# EAGLE design HM-RC-8_Remote-v02-010 (EAGLE 9.1.1)
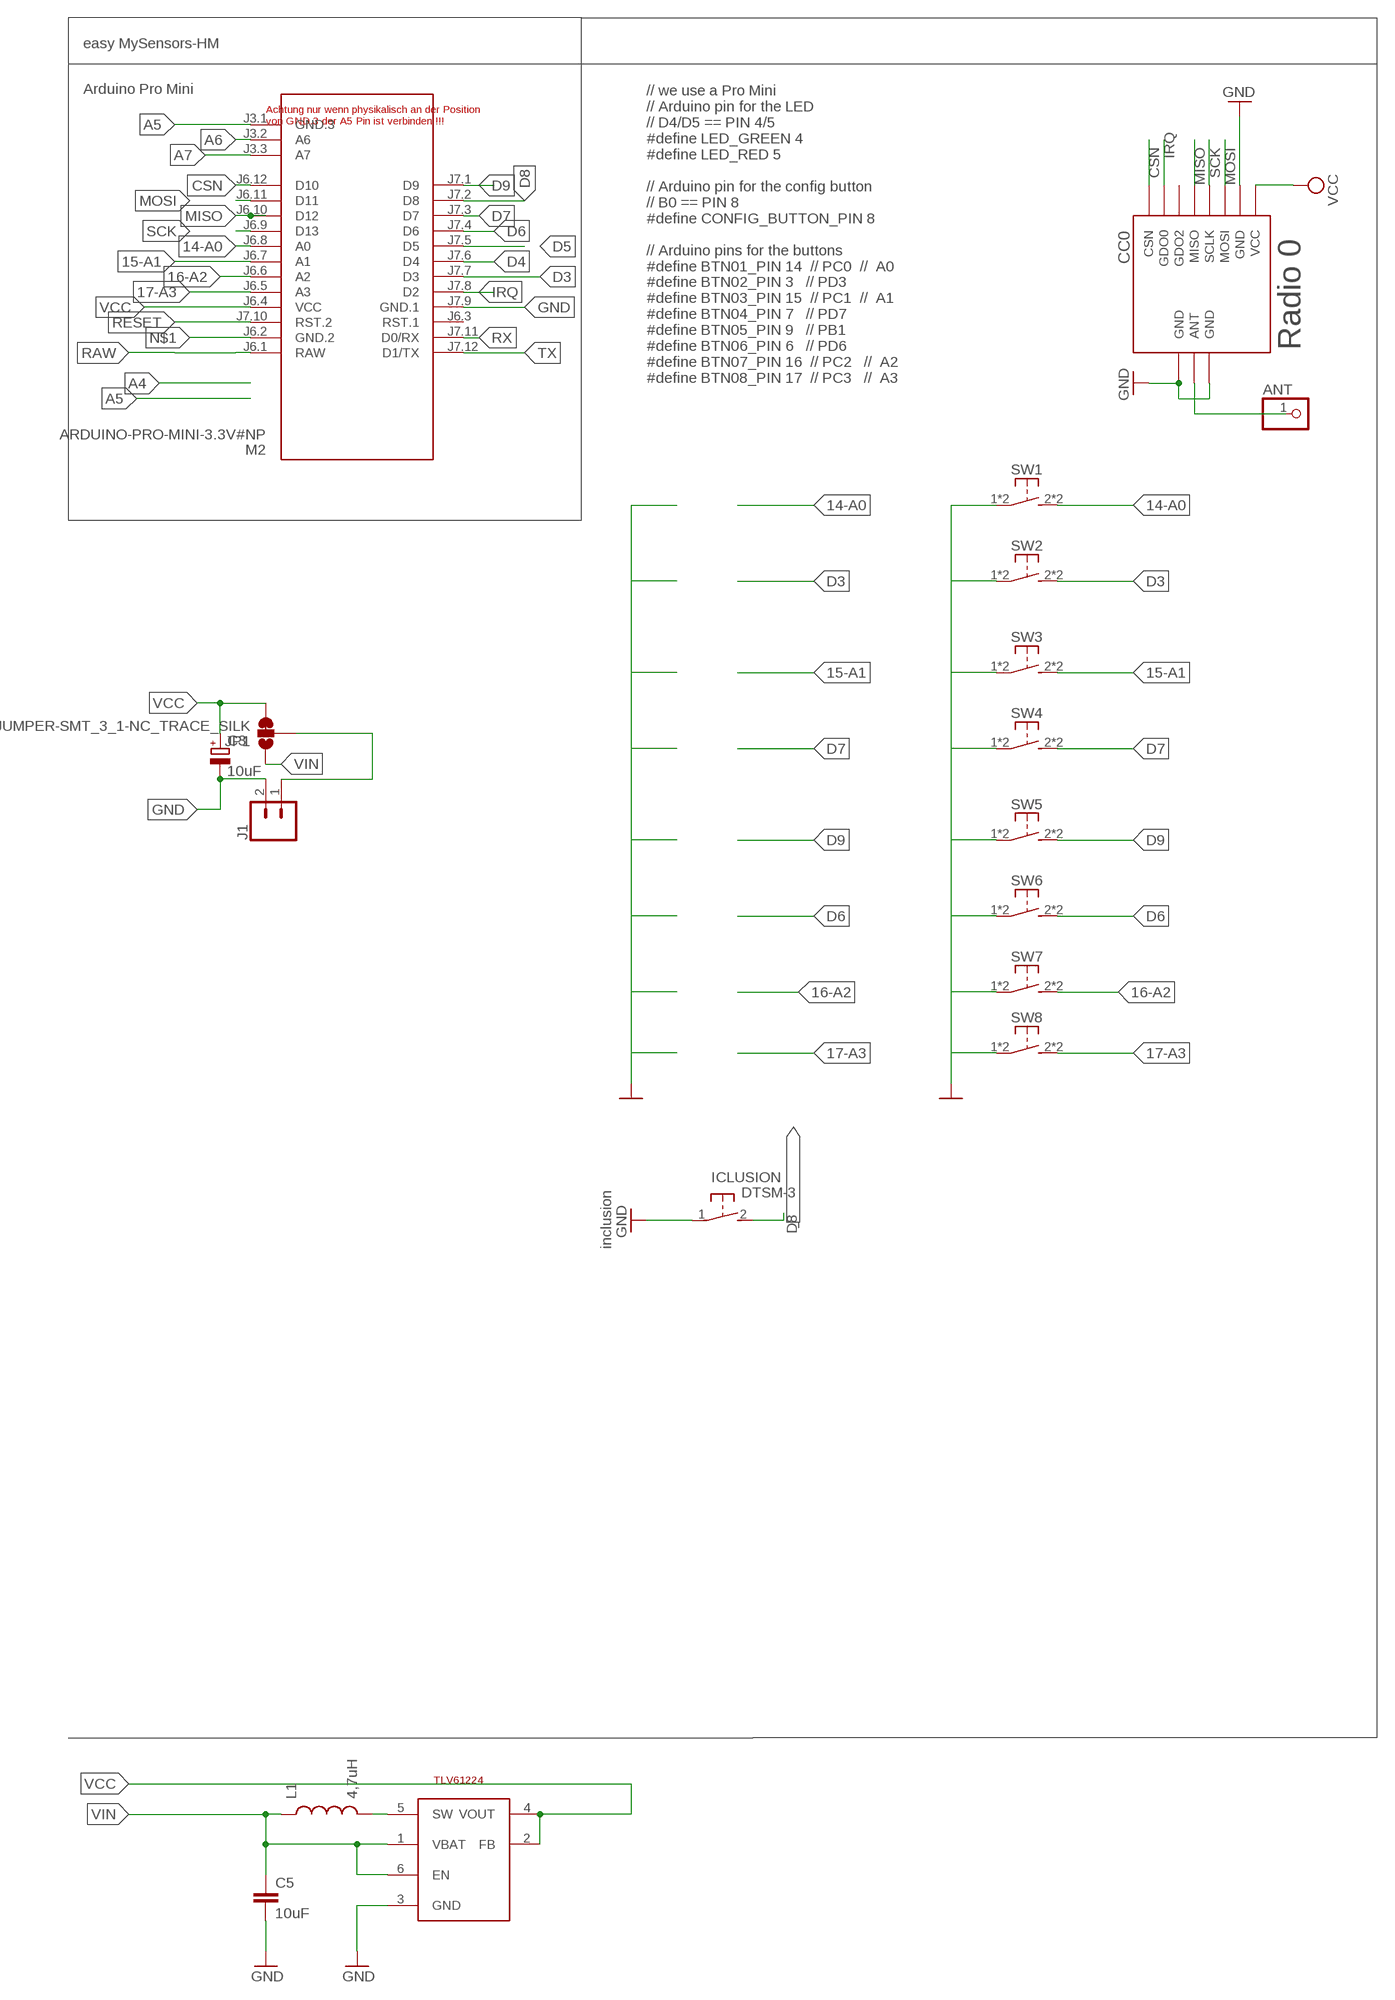
[diagram p0: schematic, sheet 1]

## Parts
ANT  PINHD-1X1  [1X01]
C3  10uF  CPOL-EUSMCC  [SMC_C]
C5  10uF  CAP0805  [0805]
CC0  CC1101  CC1101_MODULE1SMD  [CC1101_MODULE1_SMD]
ICLUSION  DTSM-3  [DTSM-3]
J1  CONN_02PTH3  [1X02_LONGPADS]
JP1  JUMPER-SMT_3_1-NC_TRACE_SILK  [SMT-JUMPER_3_1-NC_TRACE_SILK]
L1  4,7uH  INDUCTOR0805  [0805]
M2  ARDUINO-PRO-MINI-3.3V#NP  [ARDUINO-PRO-MINI#NP]
STEPUP  TLV61224  TI-TLV61224  [SOT23-6L]
SW1  SW-TACTILE-TL3305  [TL3305]
SW2  SW-TACTILE-TL3305  [TL3305]
SW3  SW-TACTILE-TL3305  [TL3305]
SW4  SW-TACTILE-TL3305  [TL3305]
SW5  SW-TACTILE-TL3305  [TL3305]
SW6  SW-TACTILE-TL3305  [TL3305]
SW7  SW-TACTILE-TL3305  [TL3305]
SW8  SW-TACTILE-TL3305  [TL3305]

## Nets
14-A0: M2.J6.8(A0) SW1.2(S1) SW1.3(S1)
15-A1: M2.J6.7(A1) SW3.2(S1) SW3.3(S1)
16-A2: M2.J6.6(A2) SW7.2(S1) SW7.3(S1)
17-A3: M2.J6.5(A3) SW8.2(S1) SW8.3(S1)
A5: M2.J3.1(GND.3)
A6: M2.J3.2(A6)
A7: M2.J3.3(A7)
ANT0: ANT.1 CC0.ANT
CSN: CC0.CSN M2.J6.12(D10)
D3: M2.J7.7(D3) SW2.2(S1) SW2.3(S1)
D4: M2.J7.6(D4)
D5: M2.J7.5(D5)
D6: M2.J7.4(D6) SW6.2(S1) SW6.3(S1)
D7: M2.J7.3(D7) SW4.2(S1) SW4.3(S1)
D8: ICLUSION.2 M2.J7.2(D8)
D9: M2.J7.1(D9) SW5.2(S1) SW5.3(S1)
GND [Power]: C3.- C5.2 CC0.GND@0(GND) CC0.GND@1(GND) CC0.GND@2(GND) ICLUSION.1 J1.2 M2.J7.9(GND.1) STEPUP.3(GND) SW1.1 SW1.4(P1) SW3.1 SW3.4(P1) SW4.1 SW4.4(P1) SW5.1 SW5.4(P1) SW6.1 SW6.4(P1) SW7.1 SW7.4(P1) SW8.1 SW8.4(P1)
IRQ: CC0.GDO0 M2.J7.8(D2)
MISO: CC0.MISO M2.J6.10(D12)
MOSI: CC0.MOSI M2.J6.11(D11)
N$1 [Power]: M2.J6.2(GND.2)
N$3: SW2.1 SW2.4(P1)
N$4: J1.1 JP1.2
N$13: L1.2 STEPUP.5(SW)
RAW [Power]: M2.J6.1(RAW)
RESET: M2.J7.10(RST.2)
RX: M2.J7.11(D0/RX)
SCK: CC0.SCLK M2.J6.9(D13)
TX: M2.J7.12(D1/TX)
VCC [Power]: C3.+ CC0.VCC JP1.3 M2.J6.4(VCC) STEPUP.2(FB) STEPUP.4(VOUT)
VIN: C5.1 JP1.1 L1.1 STEPUP.1(VBAT) STEPUP.6(EN)
Unconnected: CC0.GDO2 M2.J6.3(RST.1)

## Notes on the sheet
- easy MySensors-HM
- Arduino Pro Mini
- Achtung nur wenn physikalisch an der Position 
  von GND.3 der A5 Pin ist verbinden !!!
- Radio 0
- // we use a Pro Mini
  // Arduino pin for the LED
  // D4/D5 == PIN 4/5
  #define LED_GREEN 4
  #define LED_RED 5
  
  // Arduino pin for the config button
  // B0 == PIN 8
  #define CONFIG_BUTTON_PIN 8
  
  // Arduino pins for the buttons
  #define BTN01_PIN 14  // PC0  //  A0
  #define BTN02_PIN 3   // PD3  
  #define BTN03_PIN 15  // PC1  //  A1
  #define BTN04_PIN 7   // PD7
  #define BTN05_PIN 9   // PB1
  #define BTN06_PIN 6   // PD6
  #define BTN07_PIN 16  // PC2   //  A2
  #define BTN08_PIN 17  // PC3   //  A3
- inclusion

## Library data of the parts
ANT = pinhead:PINHD-1X1: PIN HEADER
C3 = rcl:CPOL-EU: POLARIZED CAPACITOR, European symbol; SPICEPREFIX: C
C5 = SparkFun-Passives:CAP: Capacitor Standard 0603 ceramic capacitor, and 0.1" leaded capacitor.
CC0 = wireless:CC1101_MODULE1: CC1101 wireless module for 433/868 MHz (sold from Aliexpress). DIL version for mounting with pin header (and SMD soldering) and SMD only variant available.
ICLUSION = mechanics:DTSM-3: Diptronics SMD button 6x3.5 mm
J1 = SparkFun-Connectors:CONN_02: Multi connection point. Often used as Generic Header-pin footprint for 0.1 inch spaced/style header connections On any of the 0.1 inch spaced packages, you can populate with these: Break Away Headers - Straight <https://www.sparkfun.com/products/116> (PRT-00116) Break Away Male Headers - Right Angle <https://www.sparkfun.com/products/553> (PRT-00553) Female Headers <https://www.sparkfun.com/products/115> (PRT-00115) Break Away Headers - Machine Pin <https://www.sparkfun.com/products/117> (PRT-00117) Break Away Female Headers - Swiss Machine Pin <https://www.sparkfun.com/products/743> (PRT-00743) For SCREWTERMINALS and SPRING TERMINALS visit here: Screw Terimnals on SparkFun.com <https://www.sparkfun.com/search/results?term=Screw+Terminals> (5mm/3.5mm/2.54mm spacing) This device is also useful as a general connection point to wire up your design to another part of your project. Our various solder wires solder well into these plated through hole pads. Hook-Up Wire - Assortment (Stranded, 22 AWG) <https://www.sparkfun.com/products/11375> (PRT-11375) Hook-Up Wire - Assortment (Solid Core, 22 AWG) <https://www.sparkfun.com/products/11367> (PRT-11367) View the entire wire category on our website here <https://www.sparkfun.com/categories/141> Special notes: Molex polarized connector foot print use with: PRT-08233 with associated crimp pins and housings. 2.54_SCREWTERM for use with PRT-10571. 3.5mm Screw Terminal footprints for PRT-08084 5mm Screw Terminal footprints for use with PRT-08432
JP1 = SparkFun-Jumpers:JUMPER-SMT_3_1-NC_TRACE: Normally closed trace jumper (1 of 2 connections) This jumper has a trace between two pads so it's normally closed (NC). The other connection is normally open (NO). Use a razor knife to open the connection. For best results follow the IPC guidelines for cutting traces: Cutout at least 0.063 mm (0.005 in). Remove all loose material to clean up the cut area. Seal the cut with an approved epoxy. Reapply solder to reclose the connection, or to close the NO connection.
L1 = SparkFun-Passives:INDUCTOR: Inductors Basic Inductor/Choke - 0603 and 1206. Footprints are not proven and vary greatly between part numbers.
M2 = diy-modules-Martin:ARDUINO-PRO-MINI-*#NP: Arduino Pro Mini (and compatible devices) without programming pads More details available here: https://www.arduino.cc/en/Main/ArduinoBoardProMini Click here to find device on ebay.com <http://www.ebay.com/sch/arduino+pro+mini>
STEPUP = TLV61224:TI-TLV61224
SW1-SW8 = we-switch:SW-TACTILE: Tactile Switches

## Net classes
0 default: width 0.305 mm
1 Power: width 0.508 mm

## Board
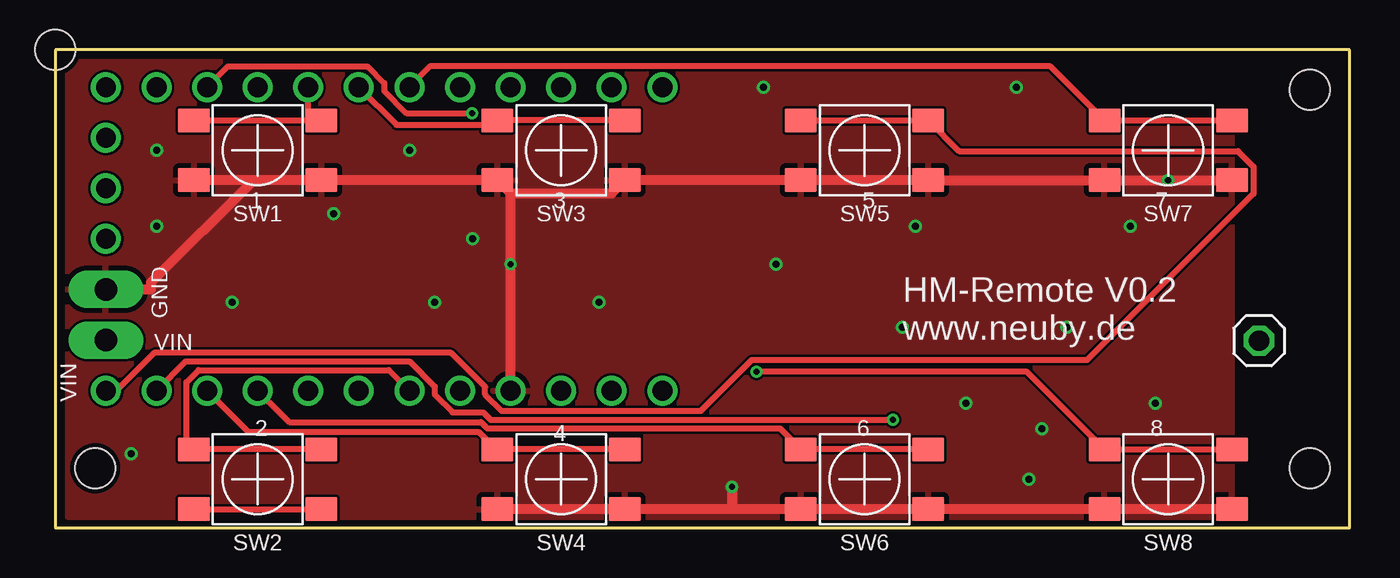
[diagram p1: board, top side]
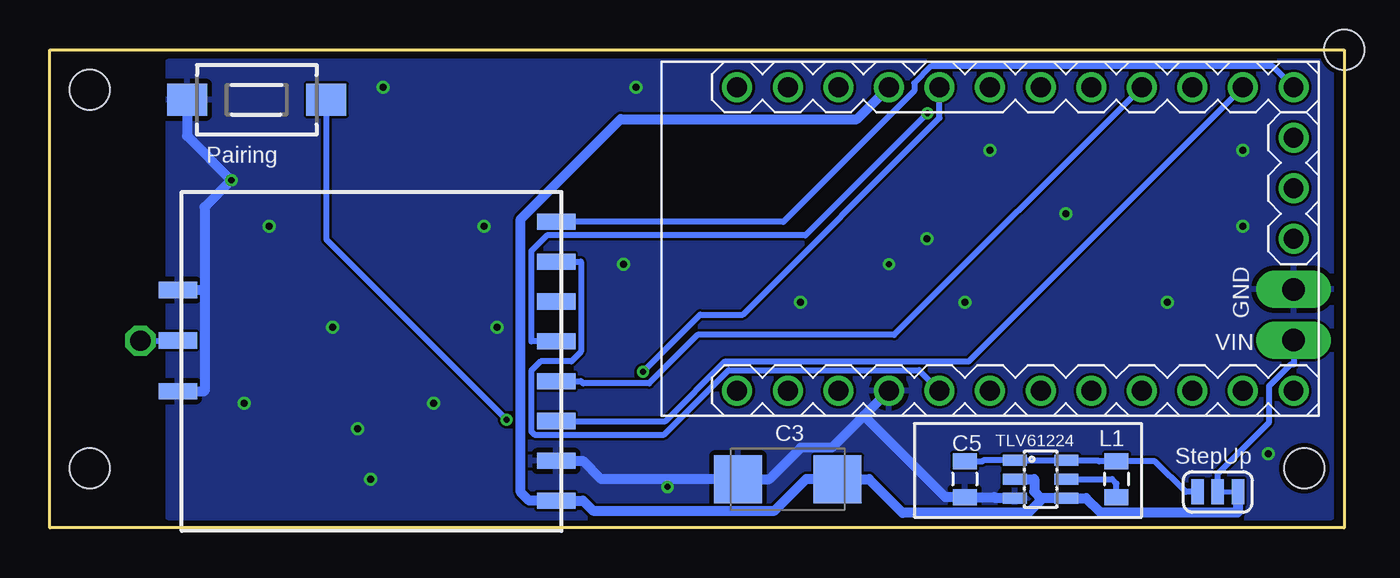
[diagram p2: board, bottom side, seen from below]

Size 65 x 24 mm. Coordinates in mm from the lower left corner, seen from the top.
Outline: 0,0 65,0 65,24 0,24 0,0
Copper layers (1*16): Top 0.035mm / dielectric 1.5mm / Bottom 0.035mm
Design rules "dirt_cheap_dirty_boards.v1": minimum track width 5mil, minimum drill 12mil, track to track 5mil, track to pad 5mil, pad to pad 5mil, via to via 5mil, smd to smd 0mil, copper to edge 10mil, drill to drill 10mil, minimum pad ring 10mil, minimum via ring 6mil, stop-mask expansion 2mil, vias tented up to drill 25mil, thermal gap 10mil
Holes 2 mm at 2,3 0,24 63,22 63,3

### Footprints (pad centres in the part's own frame; a part is rotated, then mirrored left to right if it is on the bottom)
1X01 = drill 1.016 octagon: 1 0,0
SMC_C = smd 2.4 x 2.4: + -2.5,0; - 2.5,0
0805 = smd 0.8 x 1.2: 1 -0.9,0; 2 0.9,0
CC1101_MODULE1_SMD = smd 1.93 x 0.813: ANT 19,5.96; CSN 0,0; GDO0 0,2; GDO2 0,4; GND@0 0,12; GND@1 19,8.5; GND@2 19,3.42; MISO 0,6; MOSI 0,10; SCLK 0,8; VCC 0,14
DTSM-3 = smd 2 x 1.6: 1 -3.494,0; 2 3.494,0
1X02_LONGPADS = drill 1.118 pad 1.88 long: 1 0,0; 2 2.54,0
SMT-JUMPER_3_1-NC_TRACE_SILK = smd 0.635 x 1.27: 1 -1.016,0; 2 0,0; 3 1.016,0
ARDUINO-PRO-MINI#NP = drill 1: J3.1 15.24,0; J3.2 15.24,2.54; J3.3 15.24,5.08; J6.1 -12.7,7.62; J6.2 -10.16,7.62; J6.3 -7.62,7.62; J6.4 -5.08,7.62; J6.5 -2.54,7.62; J6.6 0,7.62; J6.7 2.54,7.62; J6.8 5.08,7.62; J6.9 7.62,7.62; J6.10 10.16,7.62; J6.11 12.7,7.62; J6.12 15.24,7.62; J7.1 15.24,-7.62; J7.2 12.7,-7.62; J7.3 10.16,-7.62; J7.4 7.62,-7.62; J7.5 5.08,-7.62; J7.6 2.54,-7.62; J7.7 0,-7.62; J7.8 -2.54,-7.62; J7.9 -5.08,-7.62; J7.10 -7.62,-7.62; J7.11 -10.16,-7.62; J7.12 -12.7,-7.62
SOT23-6L = smd 0.55 x 1.2: 1 -0.95,-1.3; 2 0,-1.3; 3 0.95,-1.3; 4 0.95,1.3; 5 0,1.3; 6 -0.95,1.3
TL3305 = smd 1.6 x 1.2: 1 -3.2,1.5; 2 -3.2,-1.5; 3 3.2,-1.5; 4 3.2,1.5

### Placement (x,y rotation side)
ANT  60.45,9.4 0 top
C3  27.94,2.45 180 bottom
C5  19.05,2.45 270 bottom
CC0  39.58,15.36 180 bottom
ICLUSION  54.61,21.5 0 bottom
J1  2.54,9.43 90 top
JP1  6.35,1.81 0 bottom
L1  11.43,2.45 270 bottom
M2  17.78,14.51 0 bottom
STEPUP  15.24,2.45 270 bottom
SW1  10.16,18.95 180 top
SW2  10.16,2.45 180 top
SW3  25.4,18.95 180 top
SW4  25.4,2.45 180 top
SW5  40.64,18.95 180 top
SW6  40.64,2.45 180 top
SW7  55.88,18.95 180 top
SW8  55.88,2.45 180 top

### Tracks (layer width: path | path; a pad name or v marks a point on that pad's centre or on a via)
14-A0
  Top 0.305: 12.7,20.45 SW1.2 | SW1.3 12.7,20.45 | 12.7,20.45 M2.J6.8
15-A1
  Top 0.305: M2.J6.7 17.14,20.23 21.98,20.23 SW3.3 SW3.2
16-A2
  Top 0.305: M2.J6.6 18.81,23.16 49.97,23.16 SW7.3 SW7.2
17-A3  (via drill 0.3 pad 0.61)
  Top 0.305: v35.21,7.83 48.79,7.83 SW8.3 SW8.2
  Bottom 0.305: v35.21,7.83 32.34,10.71 30.2,10.71 20.32,20.58 M2.J6.5
ANT0
  Bottom 0.305: ANT.1 59.41,9.4 59.4,9.4 CC0.ANT
CSN
  Bottom 0.305: M2.J6.12 3.58,23.17 20.75,23.17 21.59,22.33 21.59,21.93 28.16,15.36 CC0.CSN
D3
  Top 0.305: M2.J7.7 16.74,7.93 7.19,7.93 6.59,7.32 6.59,4.32 SW2.3 SW2.2
D6
  Top 0.305: M2.J7.4 11.75,5.3 21.37,5.3 21.68,4.99 36.39,4.99 SW6.3 SW6.2
D7
  Top 0.305: M2.J7.3 9.69,4.82 21.24,4.82 22.12,3.95 SW4.3 SW4.2
D8  (via drill 0.3 pad 0.61)
  Top 0.305: M2.J7.2 6.55,8.36 17.78,8.36 19.05,7.09 19.05,6.69 19.94,5.8 21.49,5.8 21.86,5.42 v42.06,5.42
  Bottom 0.305: ICLUSION.2 51.12,14.48 v42.06,5.42
D9
  Top 0.305: M2.J7.1 3.06,6.89 4.96,8.79 19.89,8.79 21.59,7.09 21.59,6.69 22.43,5.86 32.41,5.86 34.97,8.42 51.8,8.42 60.16,16.77 60.16,18.14 59.39,18.91 45.39,18.91 SW5.2 SW5.3
GND  (via drill 0.3 pad 0.61, 0.35)
  Top 0.508: SW7.1 v55.88,17.45 SW7.4 SW5.1 SW5.4 SW3.1 27.94,16.8 22.86,16.8 | 33.98,0.94 SW4.1 SW4.4 | 33.98,0.94 SW6.4 SW6.1 SW8.4 SW8.1 | v33.98,2.05 33.98,0.94 | 22.86,16.8 SW3.4 SW1.1 9.95,17.45 | M2.J7.9 v22.86,13.24 22.86,16.8 | J1.2 4.8,11.97 4.8,12.31 9.95,17.45 | 9.95,17.45 SW1.4
  Bottom 0.508: CC0.GND@1 57.23,6.87 57.23,11.95 | 57.23,11.95 57.23,16.11 v55.88,17.45 58.1,19.68 ICLUSION.1 | CC0.GND@2 57.23,11.95 | 33.98,2.45 37.31,2.45 38.23,3.37 CC0.GND@0 | 33.98,2.45 32.02,2.45 C3.- 28.86,2.45 27.28,4.03 25.72,4.03 24.12,5.63 | 33.98,2.45 v33.98,2.05 | M2.J7.9 24.12,5.63 | 24.12,5.63 20.03,1.54 C5.2 17.57,1.54 17.52,1.5 STEPUP.3
  other vias: 20.95,14.51 17.78,18.95 5.08,18.95 5.08,15.14 3.81,3.71 8.89,11.34 19.05,11.34 13.97,15.78 27.3,11.34 35.56,22.13 48.26,22.13 43.18,15.14 36.2,13.24 42.55,10.06 50.8,10.06 53.98,15.14 55.24,6.26 49.53,4.99 45.72,6.26 48.9,2.45
  pour Bottom: 0.64,0.54 0.64,23.4 59.05,23.4 59.05,0.54
  pour Top: 0.64,0.54 0.64,23.4 59.05,23.4 59.05,0.54
IRQ
  Bottom 0.305: CC0.GDO0 38.33,13.37 38.33,8.84 38.81,8.37 40.34,8.37 40.82,7.89 40.82,4.84 40.66,4.68 34.15,4.68 30.91,7.92 21.35,7.92 M2.J7.8
MISO  (via drill 0.3 pad 0.61)
  Top 0.305: M2.J6.10 8.65,23.16 15.67,23.16 16.51,22.32 16.51,21.93 17.62,20.82 v20.92,20.82
  Bottom 0.305: v20.92,20.82 27.06,14.68 40.03,14.68 40.82,13.89 40.82,9.37 CC0.MISO
MOSI
  Bottom 0.305: CC0.MOSI 34.08,5.37 31.09,8.36 18.86,8.36 M2.J6.11
N$3
  Top 0.305: SW2.4 SW2.1
N$4
  Bottom 0.305: J1.1 2.54,8.21 2.68,8.21 3.76,7.13 3.76,5.32 6.35,2.72 JP1.2
N$13
  Bottom 0.305: STEPUP.5 11.65,2.45 11.43,2.22 L1.2
SCK
  Bottom 0.305: CC0.SCLK 38.33,7.37 38.22,7.25 34.91,7.25 32.47,9.68 22.61,9.68 M2.J6.9
VCC
  Bottom 0.508: M2.J6.4 24.47,20.52 36.34,20.52 41.35,15.5 41.35,1.8 40.92,1.37 CC0.VCC 38.9,1.37 38.23,1.37 37.73,0.86 28.6,0.86 27.02,2.45 C3.+ 23.86,2.45 22.17,0.76 15.86,0.76 15.23,1.39 15.23,1.5 | 15.23,1.5 15.56,1.83 15.56,2.45 STEPUP.2 | 15.23,1.5 14.92,1.5 STEPUP.4 13.45,1.5 12.96,1.5 12.23,0.76 5.36,0.76 5.33,0.79 JP1.3
VIN
  Bottom 0.305: C5.1 18.17,3.34 18.12,3.39 STEPUP.1 STEPUP.6 12.36,3.39 12.31,3.34 L1.1 9.5,3.34 7.96,1.81 JP1.1

### Text on the board
tNames: 1 | 3 | 5 | 7 | GND | VIN | HM-Remote V0.2 / www.neuby.de | VIN | 2 | 6 | 8 | 4
bNames: Pairing | GND | VIN | L1 | TLV61224 | C5 | C3 | StepUp